# EAGLE design loki (EAGLE 6.2)
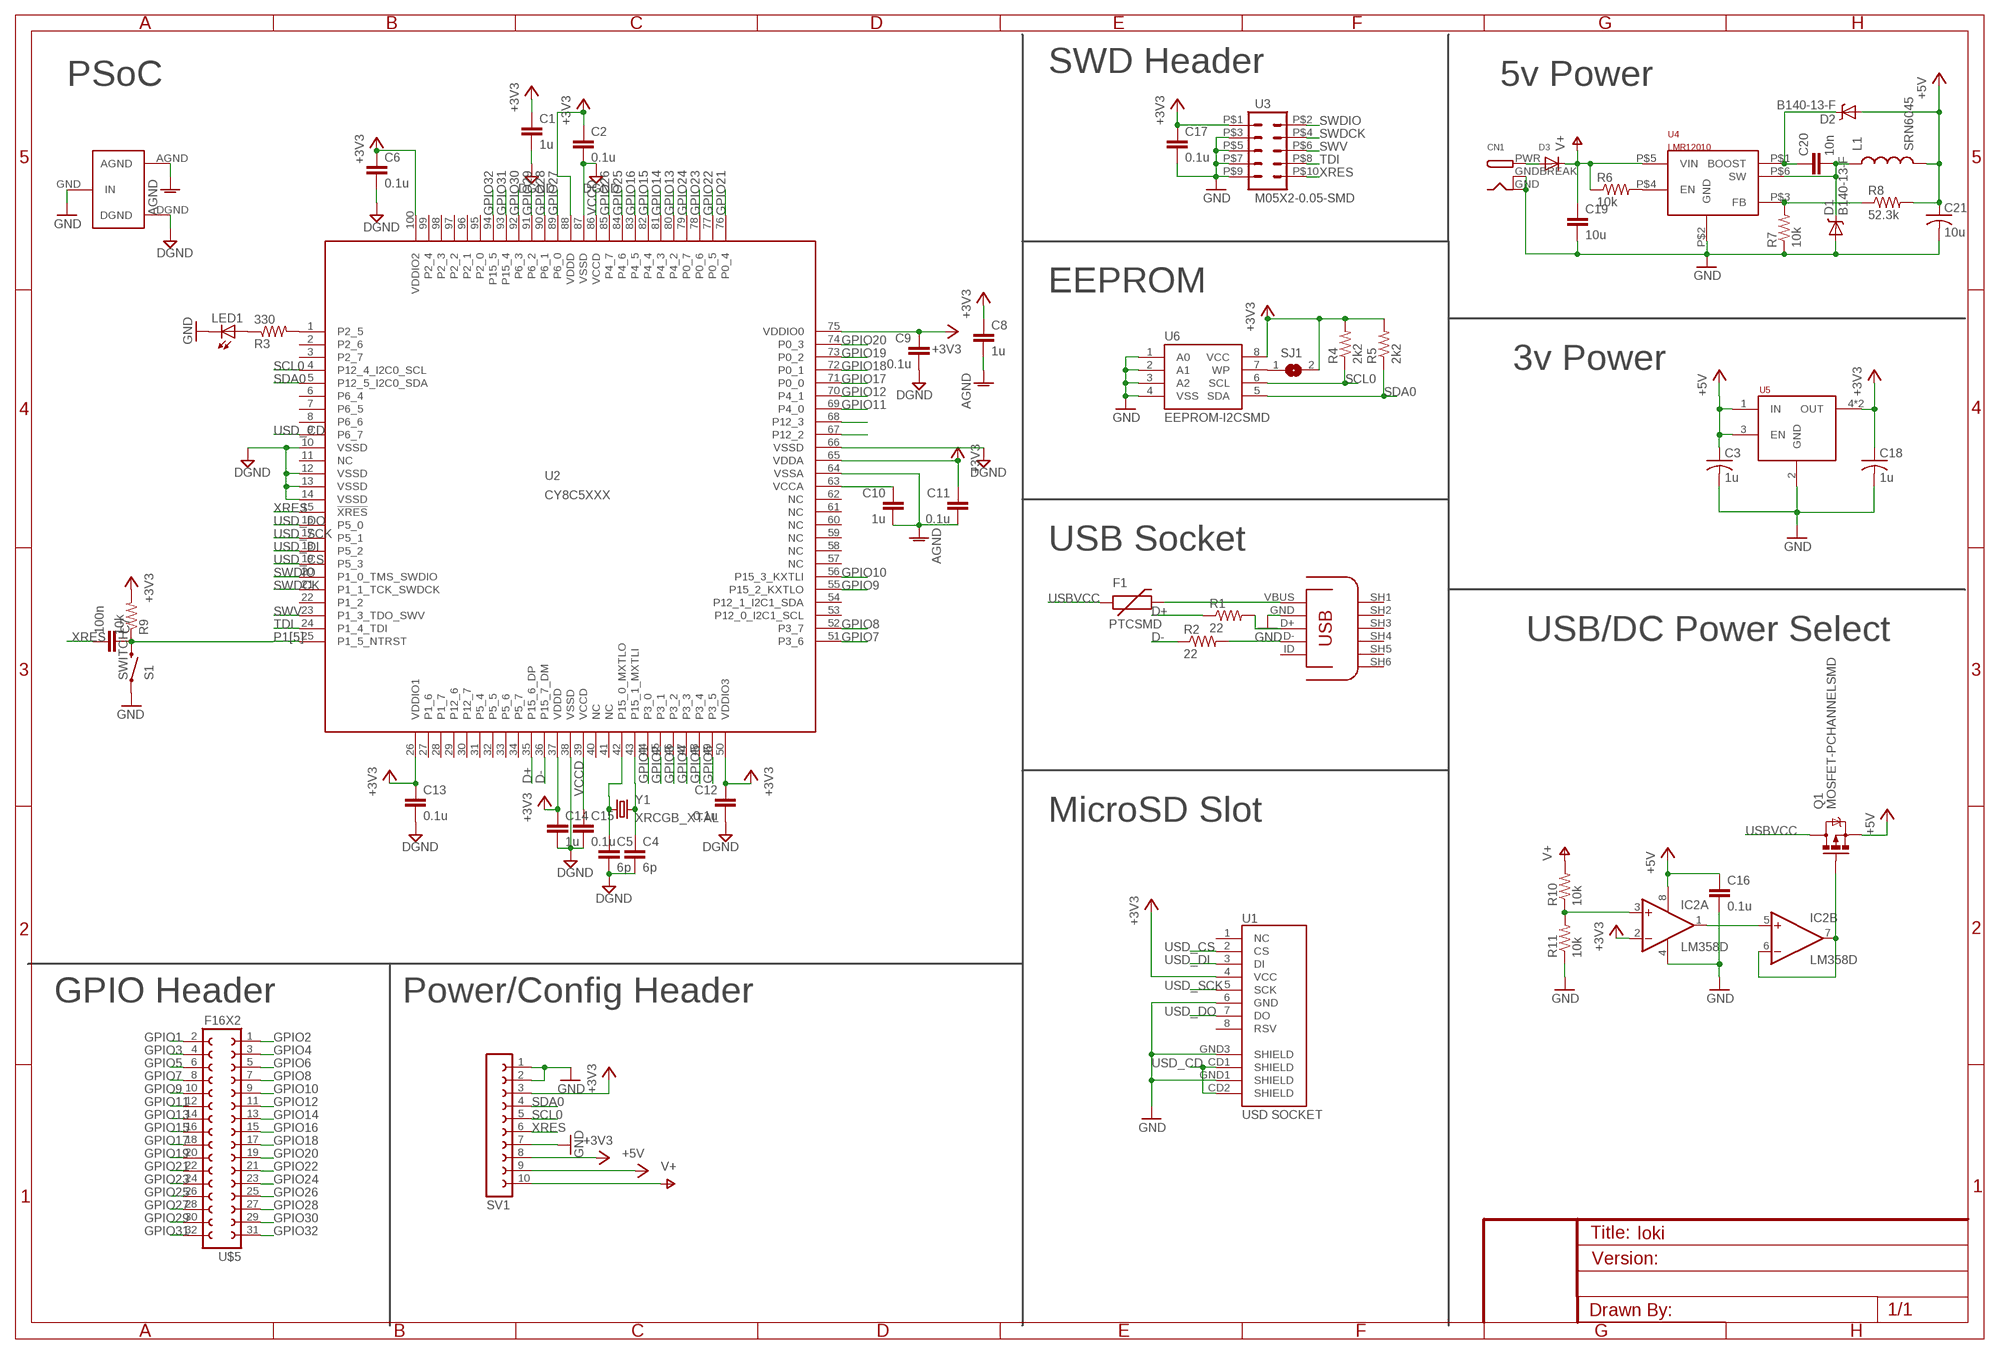
[diagram p0: schematic, sheet 1]

## Parts
C1  1u  C-EUC0603K  [C0603K]
C2  0.1u  C-EUC0603K  [C0603K]
C3  1u  C-USC0603  [C0603]
C4  6p  C-EUC0603K  [C0603K]
C5  6p  C-EUC0603K  [C0603K]
C6  0.1u  C-EUC0603K  [C0603K]
C7  100n  C-EUC0603K  [C0603K]
C8  1u  C-EUC0603K  [C0603K]
C9  0.1u  C-EUC0603K  [C0603K]
C10  1u  C-EUC0603K  [C0603K]
C11  0.1u  C-EUC0603K  [C0603K]
C12  0.1u  C-EUC0603K  [C0603K]
C13  0.1u  C-EUC0603K  [C0603K]
C14  1u  C-EUC0603K  [C0603K]
C15  0.1u  C-EUC0603K  [C0603K]
C16  0.1u  CAP0603-CAP  [0603-CAP]
C17  0.1u  C-EUC0603K  [C0603K]
C18  1u  C-USC0603  [C0603]
C19  10u  C-EUC1210  [C1210]
C20  10n  C-EUC0805  [C0805]
C21  10u  C-USC1206  [C1206]
CN1  DCBARRELPTH  [DCJACK_2MM_PTH]
D1  B140-13-F  DIODE-SCHOTTKY_  [SMA-DIODE]
D2  B140-13-F  DIODE-SCHOTTKY_  [SMA-DIODE]
D3  DIODESMA  [SMADIODE]
F1  PTCSMD  [PTC-1206]
IC2  LM358D  [SO08]
L1  SRN6045  [SRN6045]
LED1  LEDCHIP-LED0805  [CHIP-LED0805]
Q1  MOSFET-PCHANNELSMD  [SOT23-3]
R1  22  RESISTOR0603-RES  [0603-RES]
R2  22  RESISTOR0603-RES  [0603-RES]
R3  330  R-US_R0603  [R0603]
R4  2k2  R-US_R0603  [R0603]
R5  2k2  R-US_R0603  [R0603]
R6  10k  R-US_R0603  [R0603]
R7  10k  R-US_R0603  [R0603]
R8  52.3k  R-US_R0603  [R0603]
R9  10k  R-US_R0603  [R0603]
R10  10k  R-US_R0603  [R0603]
R11  10k  R-US_R0603  [R0603]
S1  SWITCH  SWITCH-MOMENTARY-2SMD  [TACTILE_SWITCH_SMD]
SJ1  SJ  [SJ]
SV1  FE10-1  [FE10]
U1  USD SOCKET  USD-SOCKETNEW  [MICRO-SD-SOCKET-PP]
U2  CY8C5XXX  CY8C5XXX-100PIN  [TQFP-14X14-100]
U3  M05X2-0.05-SMD  [PINHD-2X5-0.05-SMD]
U4  LMR12010  [TSOT-6]
U5  TLV702XX  [SOT23-5]
U6  EEPROM-I2CSMD  [SO08]
U7  MICROUSB  [USB-MICROB]
U$5  F16X2  [FE16-2]
U$9  GND_CONNECT  [GNDCONNECT]
Y1  XRCGB_XTAL  [XRCGB-XTAL]

## Nets
+3V3: C1.1 C2.1 C6.1 C8.1 C9.1 C11.1 C12.1 C13.1 C14.1 C17.1 C18.1 IC2.2(A:-IN) R4.2 R5.2 R9.2 SJ1.2 SV1.3 SV1.8 U1.4(VCC) U2.26(VDDIO1) U2.37(VDDD) U2.50(VDDIO3) U2.65(VDDA) U2.75(VDDIO0) U2.88(VDDD) U2.100(VDDIO2) U3.P$1 U5.4(OUT) U5.5(OUT) U6.8(VCC)
+5V: C3.1 C16.1 C21.1 D2.A IC2.8(P:V+) L1.P$2 Q1.2(S) R8.2 SV1.9 U5.1(IN) U5.3(EN)
AGND: C8.2 C10.2 C11.2 U2.64(VSSA) U$9.AGND
BOOST: C20.1 D2.C U4.P$1(BOOST)
CLKI: C4.1 U2.43(P15_1_MXTLI) Y1.2
CLKO: C5.1 U2.42(P15_0_MXTLO) Y1.1
D+: R1.1 U2.35(P15_6_DP)
D+IN: R1.2 U7.D+
D-: R2.1 U2.36(P15_7_DM)
D-IN: R2.2 U7.D-
DCIN: CN1.PWR D3.A
DGND: C1.2 C2.2 C4.2 C5.2 C6.2 C9.2 C12.2 C13.2 C14.2 C15.2 U2.10(VSSD) U2.12(VSSD) U2.13(VSSD) U2.14(VSSD) U2.38(VSSD) U2.66(VSSD) U2.87(VSSD) U$9.DGND
FB: R7.2 R8.1 U4.P$3(FB)
GND: C3.2 C16.2 C17.2 C18.2 C19.2 C21.2 CN1.GND CN1.GNDBREAK D1.A IC2.4(P:V-) LED1.C R7.1 R11.1 S1.1 SV1.1 SV1.2 SV1.7 U1.6(GND) U1.GND1(SHIELD) U1.GND3(SHIELD) U3.P$3 U3.P$5 U3.P$7 U3.P$9 U4.P$2(GND) U5.2(GND) U6.1(A0) U6.2(A1) U6.3(A2) U6.4(VSS) U7.GND U$9.GND(IN)
GPIO1: U2.44(P3_0) U$5.2
GPIO2: U2.45(P3_1) U$5.1
GPIO3: U2.46(P3_2) U$5.4
GPIO4: U2.47(P3_3) U$5.3
GPIO5: U2.48(P3_4) U$5.6
GPIO6: U2.49(P3_5) U$5.5
GPIO7: U2.51(P3_6) U$5.8
GPIO8: U2.52(P3_7) U$5.7
GPIO9: U2.55(P15_2_KXTLO) U$5.10
GPIO10: U2.56(P15_3_KXTLI) U$5.9
GPIO11: U2.69(P4_0) U$5.12
GPIO12: U2.70(P4_1) U$5.11
GPIO13: U2.80(P4_2) U$5.14
GPIO14: U2.81(P4_3) U$5.13
GPIO15: U2.82(P4_4) U$5.16
GPIO16: U2.83(P4_5) U$5.15
GPIO17: U2.71(P0_0) U$5.18
GPIO18: U2.72(P0_1) U$5.17
GPIO19: U2.73(P0_2) U$5.20
GPIO20: U2.74(P0_3) U$5.19
GPIO21: U2.76(P0_4) U$5.22
GPIO22: U2.77(P0_5) U$5.21
GPIO23: U2.78(P0_6) U$5.24
GPIO24: U2.79(P0_7) U$5.23
GPIO25: U2.84(P4_6) U$5.26
GPIO26: U2.85(P4_7) U$5.25
GPIO27: U2.89(P6_0) U$5.28
GPIO28: U2.90(P6_1) U$5.27
GPIO29: U2.91(P6_2) U$5.30
GPIO30: U2.92(P6_3) U$5.29
GPIO31: U2.93(P15_4) U$5.32
GPIO32: U2.94(P15_5) U$5.31
INDIN: C20.2 D1.C L1.P$1 U4.P$6(SW)
N$1: U2.67(P12_2)
N$2: R3.2 U2.1(P2_5)
N$3: C10.1 U2.63(VCCA)
N$5: R6.2 U4.P$4(EN)
N$9: SJ1.1 U6.7(WP)
N$10: U2.68(P12_3)
N$12: IC2.3(A:+IN) R10.1 R11.2
N$13: IC2.6(B:-IN) IC2.7(B:OUT) Q1.1(G)
N$14: IC2.1(A:OUT) IC2.5(B:+IN)
N$25: LED1.A R3.1
P1[5]: C7.1 R9.1 S1.3 U2.25(P1_5_NTRST)
SCL0: R4.1 SV1.5 U2.4(P12_4_I2C0_SCL) U6.6(SCL)
SDA0: R5.1 SV1.4 U2.5(P12_5_I2C0_SDA) U6.5(SDA)
SWDCK: U2.21(P1_1_TCK_SWDCK) U3.P$4
SWDIO: U2.20(P1_0_TMS_SWDIO) U3.P$2
SWV: U2.23(P1_3_TDO_SWV) U3.P$6
TDI: U2.24(P1_4_TDI) U3.P$8
USBVCC: F1.1 Q1.3(D)
USD_CD: U1.CD1(SHIELD) U1.CD2(SHIELD) U2.9(P6_7)
USD_CS: U1.2(CS) U2.19(P5_3)
USD_DI: U1.3(DI) U2.18(P5_2)
USD_DO: U1.7(DO) U2.16(P5_0)
USD_SCK: U1.5(SCK) U2.17(P5_1)
V+: C19.1 D3.C R6.1 R10.2 SV1.10 U4.P$5(VIN)
VBUS: F1.2 U7.VBUS(VCC)
VCCD: C15.1 U2.39(VCCD) U2.86(VCCD)
XRES: C7.2 SV1.6 U2.15(!XRES!) U3.P$10
Unconnected: U1.1(NC) U1.8(RSV) U2.2(P2_6) U2.3(P2_7) U2.6(P6_4) U2.7(P6_5) U2.8(P6_6) U2.11(NC) U2.22(P1_2) U2.27(P1_6) U2.28(P1_7) U2.29(P12_6) U2.30(P12_7) U2.31(P5_4) U2.32(P5_5) U2.33(P5_6) U2.34(P5_7) U2.40(NC) U2.41(NC) U2.53(P12_0_I2C1_SCL) U2.54(P12_1_I2C1_SDA) U2.57(NC) U2.58(NC) U2.59(NC) U2.60(NC) U2.61(NC) U2.62(NC) U2.95(P2_0) U2.96(P2_1) U2.97(P2_2) U2.98(P2_3) U2.99(P2_4) U7.ID U7.SH1(SH) U7.SH2(SH) U7.SH3(SH) U7.SH4(SH) U7.SH5(SH) U7.SH6(SH)

## Notes on the sheet
- SWD Header
- PSoC | 5v Power
- EEPROM
- 3v Power
- USB Socket
- USB/DC Power Select
- MicroSD Slot
- GPIO Header | Power/Config Header

## Library data of the parts
C1 C2 C4-C15 C17 C19 C20 = resistor:C-EU: CAPACITOR, European symbol
C3 C18 C21 = resistor:C-US: CAPACITOR, American symbol
C16 = SparkFun-Passives:CAP: Capacitor Standard 0603 ceramic capacitor, and 0.1" leaded capacitor.
CN1 = adafruit:DCBARREL: 2.0mm DC Barrel Jack DCJACK_2MM_PTH - Through Hole Jack (4UConnector: 05537)
D1 D2 = SparkFun-DiscreteSemi:DIODE-SCHOTTKY: Commonly MBRA140.
D3 = adafruit:DIODE: Diode SMADIODE - SMA Surface Mount Package 20V 1A Schottky Diode Digikey: 641-1014-6-ND DO-1N4148 - Through Hole Small Current Diode SOD-123 20V 1 A (.5mV Vf) Schottky Diode - Digikey: MBRX120TPMSCT-ND SOD-323 10V 570mA (.38mV Vf, 3ns) Schottky Diode - Digikey: ZLLS410CT-ND SOD-523 30V 30mA Schottky Diode (RB751S-40TE61) - Digikey: RB751S-40TE61CT-ND SOT23-R/W - SOT23 Package (R = Solder Paste/Reflow Ovens, W = Hand-Soldering) BAT54Film 40V 300mA - Digikey: 497-7162-1-ND
F1 = SparkFun-PowerIC:PTC: Resettable Fuse PTC Resettable Fuse. Spark Fun Electronics SKU : COM-08357
IC2 = linear:LM358: OP AMP also LM158; LM258; LM2904 Source: http://cache.national.com/ds/LM/LM158.pdf
L1 = nickparts:SRN6045
LED1 = led:LED: LED OSRAM: - CHIPLED LG R971, LG N971, LY N971, LG Q971, LY Q971, LO R971, LY R971 LH N974, LH R974 LS Q976, LO Q976, LY Q976 LO Q996 - Hyper CHIPLED LW Q18S LB Q993, LB Q99A, LB R99A - SideLED LS A670, LO A670, LY A670, LG A670, LP A670 LB A673, LV A673, LT A673, LW A673 LH A674 LY A675 LS A676, LA A676, LO A676, LY A676, LW A676 LS A679, LY A679, LG A679 - Hyper Micro SIDELED® LS Y876, LA Y876, LO Y876, LY Y876 LT Y87S - SmartLED LW L88C, LW L88S LB L89C, LB L89S, LG L890 LS L89K, LO L89K, LY L89K LS L896, LA L896, LO L896, LY L896 - TOPLED LS T670, LO T670, LY T670, LG T670, LP T670 LSG T670, LSP T670, LSY T670, LOP T670, LYG T670 LG T671, LOG T671, LSG T671 LB T673, LV T673, LT T673, LW T673 LH T674 LS T676, LA T676, LO T676, LY T676, LB T676, LH T676, LSB T676, LW T676 LB T67C, LV T67C, LT T67C, LS T67K, LO T67K, LY T67K, LW E67C LS E67B, LA E67B, LO E67B, LY E67B, LB E67C, LV E67C, LT E67C LW T67C LS T679, LY T679, LG T679 LS T770, LO T770, LY T770, LG T770, LP T770 LB T773, LV T773, LT T773, LW T773 LH T774 LS E675, LA E675, LY E675, LS T675 LS T776, LA T776, LO T776, LY T776, LB T776 LHGB T686 LT T68C, LB T68C - Hyper Mini TOPLED® LB M676 - Mini TOPLED Santana® LG M470 LS M47K, LO M47K, LY M47K Source: http://www.osram.convergy.de LUXEON: - LUMILED® LXK2-PW12-R00, LXK2-PW12-S00, LXK2-PW14-U00, LXK2-PW14-V00 LXK2-PM12-R00, LXK2-PM12-S00, LXK2-PM14-U00 LXK2-PE12-Q00, LXK2-PE12-R00, LXK2-PE12-S00, LXK2-PE14-T00, LXK2-PE14-U00 LXK2-PB12-K00, LXK2-PB12-L00, LXK2-PB12-M00, LXK2-PB14-N00, LXK2-PB14-P00, LXK2-PB14-Q00 LXK2-PR12-L00, LXK2-PR12-M00, LXK2-PR14-Q00, LXK2-PR14-R00 LXK2-PD12-Q00, LXK2-PD12-R00, LXK2-PD12-S00 LXK2-PH12-R00, LXK2-PH12-S00 LXK2-PL12-P00, LXK2-PL12-Q00, LXK2-PL12-R00 Source: www.luxeon.com KINGBRIGHT: KA-3528ASYC Source: www.kingbright.com
Q1 = SparkFun-DiscreteSemi:MOSFET-PCHANNEL: Generic PMOSFET
R1 R2 = SparkFun-Passives:RESISTOR: Resistor Basic schematic elements and footprints for 0603, 1206, and PTH resistors.
R3-R11 = resistor:R-US_: RESISTOR, American symbol
S1 = SparkFun-Electromechanical:SWITCH-MOMENTARY-2: Various NO switches- pushbuttons, reed, etc
SJ1 = jumper:SJ: SMD solder JUMPER
SV1 = con-lsta:FE10-1: FEMALE HEADER; OC_FARNELL: unknown; OC_NEWARK: unknown
U1 = SparkFun-Connectors:USD-SOCKET: microSD Socket Push-push type uSD socket. Schematic element and footprint production proven. Spark Fun Electronics SKU : PRT-00127. tDoc lines correctly indicate media card edge positions when inserting (unlocked, locked, depressed).
U2 = cypress_psoc_V1_0:CY8C5XXX-100PIN: Cypress PSoC® 5 - Programmable System on Chip, ARM Cortex-M3 Based Source Data: http://www.cypress.com/?mpn=CY8C5588AXI-060 LBR Source: http://www.westmarkelectronics.com Thomas W. Moxon Director of Engineering www.westmarkelectronics.com; MPN: CY8C5588AXI-060
U3 = nickparts:M05X2-0.05-SMD
U4 = nickparts:LMR12010
U5 = nickparts:TLV702XX
U6 = SparkFun-DigitalIC:EEPROM-I2C: I2C EEPROM chips, 24LC256 (and others)
U7 = ondraster:MICROUSB
U$5 = nickparts:F16X2
U$9 = nickparts:GND_CONNECT: Use to make a connection of multiple grounds in only one place.
Y1 = nickparts:XRCGB_XTAL

## Board
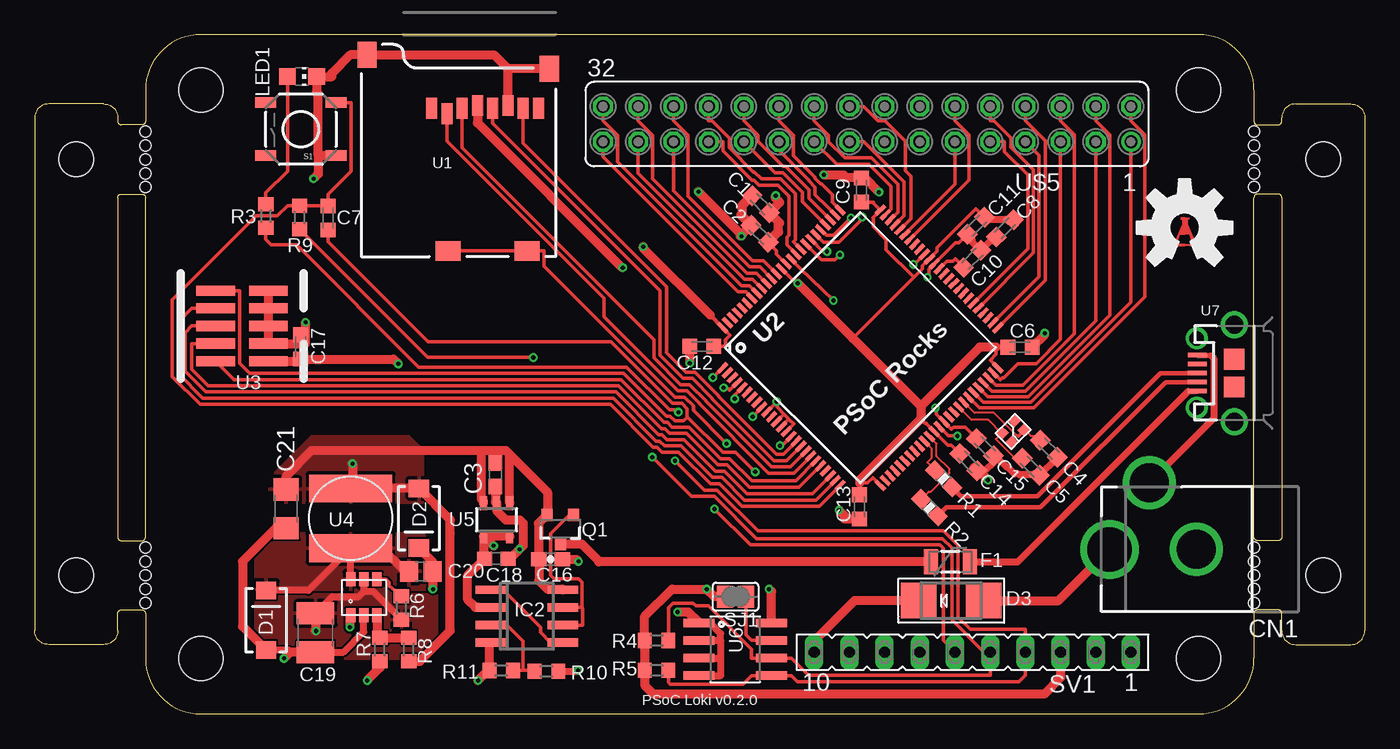
[diagram p1: board, top side]
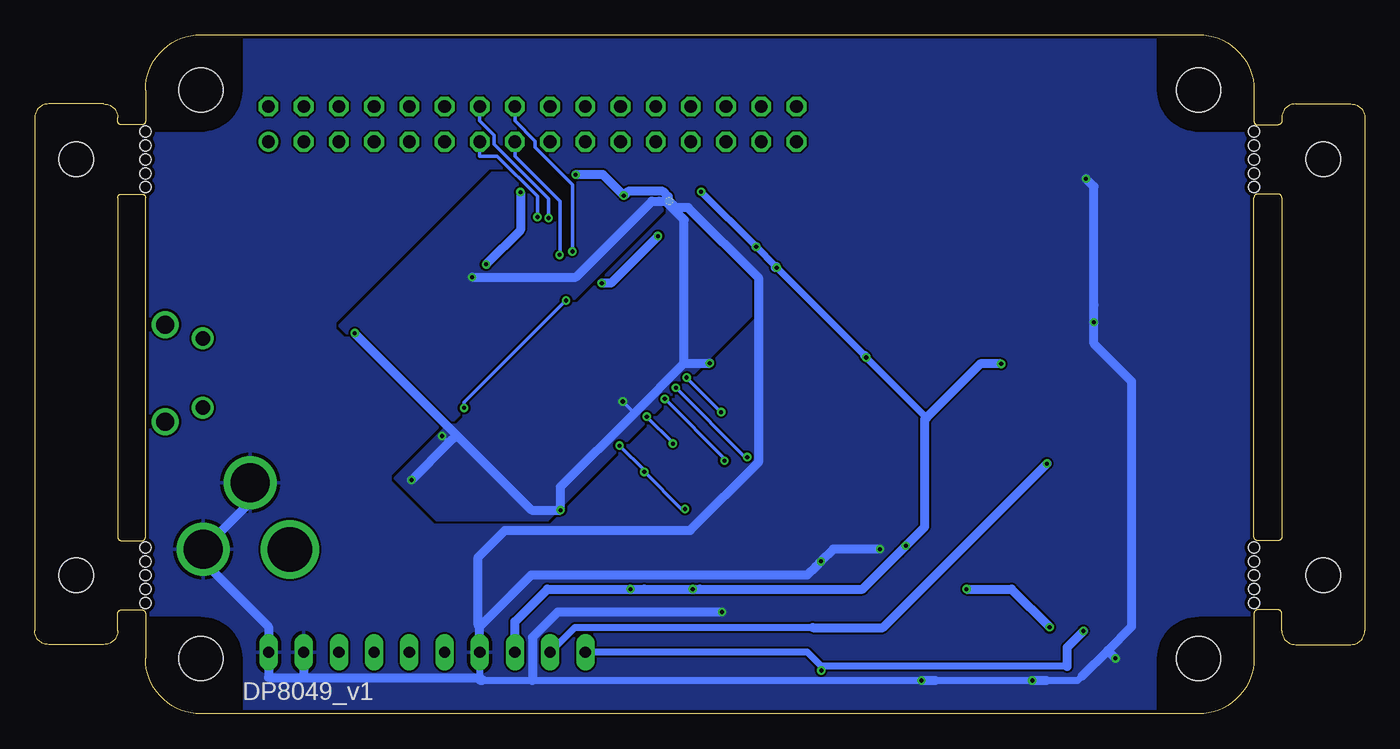
[diagram p2: board, bottom side, seen from below]

Size 96 x 49 mm. Coordinates in mm from the lower left corner, seen from the top.
Outline: 90,29 90,20
Outline: 12,0 84,0 arc90 88,4 88,7.25 arc-90 88.25,7.5 89.75,7.5 arc-90 90,7.25 90,6 arc90 91,5 95,5 arc90 96,6 96,43 arc90 95,44 91,44 arc90 90,43 90,42.75 arc-90 89.75,42.5 88.25,42.5 arc-90 88,42.75 88,45 arc90 84,49 12,49 arc90 8,45 8,42.75 arc-90 7.75,42.5 6.25,42.5 arc-90 6,42.75 6,43 arc90 5,44 1,44 arc90 0,43 0,6 arc90 1,5 5,5 arc90 6,6 6,7.25 arc-90 6.25,7.5 7.75,7.5 arc-90 8,7.25 8,4 arc90 12,0
Outline: 6,37.25 6,12.75 arc90 6.25,12.5 7.75,12.5 arc90 8,12.75 8,37.25 arc90 7.75,37.5 6.25,37.5 arc90 6,37.25
Outline: 90,37.25 90,12.75 arc-90 89.75,12.5 88.25,12.5 arc-90 88,12.75 88,37.25 arc-90 88.25,37.5 89.75,37.5 arc-90 90,37.25
Copper layers (1*16): Top 0.035mm / dielectric 1.5mm / Bottom 0.035mm
Design rules: minimum track width 6mil, minimum drill 0.3mm, track to track 6mil, track to pad 6mil, pad to pad 6mil, via to via 6mil, smd to smd 0mil, copper to edge 10mil, drill to drill 10mil, minimum pad ring 10mil, minimum via ring 6mil, stop-mask expansion 2mil, vias tented up to drill 100mil, thermal gap 10mil
Holes 3.2 mm at 12,4 84,4 84,45 12,45
Holes 2.5 mm at 3,40 3,10 93,40 93,10
Holes 0.8 mm at 8,42 8,41 8,40 8,39 8,38 8,12 8,11 8,10 8,9 8,8 88,42 88,41 88,40 88,39 88,38 88,12 88,11 88,10 88,9 88,8
tKeepout: 8 lines
bKeepout: 8 lines
tRestrict: area 8,42 to 15,49; area 81,42 to 88,49; area 8,0 to 15,7; area 81,0 to 88,7
bRestrict: area 8,42 to 15,49; area 81,42 to 88,49; area 8,0 to 15,7; area 81,0 to 88,7

### Footprints (pad centres in the part's own frame; a part is rotated, then mirrored left to right if it is on the bottom)
C0603K = smd 1.05 x 1.08: 1 -0.875,0; 2 0.875,0
C0603 = smd 1.1 x 1: 1 -0.85,0; 2 0.85,0
0603-CAP = smd 1.1 x 1: 1 -0.85,0; 2 0.85,0
C1210 = smd 1.6 x 2.7: 1 -1.4,0; 2 1.4,0
C0805 = smd 1.3 x 1.5: 1 -0.85,0; 2 0.85,0
C1206 = smd 1.6 x 1.8: 1 -1.4,0; 2 1.4,0
DCJACK_2MM_PTH = drill 2.8: GND 0,7.35; GNDBREAK 4.8,10.75 | drill 3.2: PWR 0,13.6
SMA-DIODE = smd 1.27 x 1.47: A -2.15,0; C 2.15,0
SMADIODE = smd 2.54 x 2.54: A 2.349,0; C -2.349,0
PTC-1206 = smd 1 x 1.8: 1 -1.4,0; 2 1.4,0
SO08 = smd 0.6 x 2.2: 1 -1.905,-2.6; 2 -0.635,-2.6; 3 0.635,-2.6; 4 1.905,-2.6; 5 1.905,2.6; 6 0.635,2.6; 7 -0.635,2.6; 8 -1.905,2.6
SRN6045 = smd 2 x 6: P$1 -2.15,0; P$2 2.15,0
CHIP-LED0805 = smd 1.2 x 1.2: A 0,-1.05; C 0,1.05
SOT23-3 = smd 0.8 x 0.9: 1 -0.95,-1; 2 0.95,-1; 3 0,1.1
0603-RES = smd 1.1 x 1: 1 -0.85,0; 2 0.85,0
R0603 = smd 1 x 1.1: 1 -0.85,0; 2 0.85,0
TACTILE_SWITCH_SMD = smd 1.524 x 0.762: 1 -2.54,1.905; 2 2.54,1.905; 3 -2.54,-1.905; 4 2.54,-1.905
SJ = smd 1.168 x 1.6: 1 -0.762,0; 2 0.762,0
FE10 = drill 0.813 long: 1 -11.43,0; 2 -8.89,0; 3 -6.35,0; 4 -3.81,0; 5 -1.27,0; 6 1.27,0; 7 3.81,0; 8 6.35,0; 9 8.89,0; 10 11.43,0
MICRO-SD-SOCKET-PP = smd 0.8 x 1.5: 1 -8.94,10.7; 2 -7.84,10.3; 3 -6.74,10.7; 4 -5.64,10.9; 5 -4.54,10.7; 6 -3.44,10.9; 7 -2.34,10.7; 8 -1.24,10.7 | smd 1.8 x 1.4: CD1 -2.05,0.4; CD2 -7.75,0.4 | smd 1.4 x 1.9: GND1 -13.6,14.55; GND3 -0.45,13.55
TQFP-14X14-100 = smd 0.9 x 0.3: 1 -8.05,6; 2 -8.05,5.5; 3 -8.05,5; 4 -8.05,4.5; 5 -8.05,4; 6 -8.05,3.5; 7 -8.05,3; 8 -8.05,2.5; 9 -8.05,2; 10 -8.05,1.5; 11 -8.05,1; 12 -8.05,0.5; 13 -8.05,0; 14 -8.05,-0.5; 15 -8.05,-1; 16 -8.05,-1.5; 17 -8.05,-2; 18 -8.05,-2.5; 19 -8.05,-3; 20 -8.05,-3.5; 21 -8.05,-4; 22 -8.05,-4.5; 23 -8.05,-5; 24 -8.05,-5.5; 25 -8.05,-6; 51 8.05,-6; 52 8.05,-5.5; 53 8.05,-5; 54 8.05,-4.5; 55 8.05,-4; 56 8.05,-3.5; 57 8.05,-3; 58 8.05,-2.5; 59 8.05,-2; 60 8.05,-1.5; 61 8.05,-1; 62 8.05,-0.5; 63 8.05,0; 64 8.05,0.5; 65 8.05,1; 66 8.05,1.5; 67 8.05,2; 68 8.05,2.5; 69 8.05,3; 70 8.05,3.5; 71 8.05,4; 72 8.05,4.5; 73 8.05,5; 74 8.05,5.5; 75 8.05,6 | smd 0.3 x 0.9: 26 -6,-8.05; 27 -5.5,-8.05; 28 -5,-8.05; 29 -4.5,-8.05; 30 -4,-8.05; 31 -3.5,-8.05; 32 -3,-8.05; 33 -2.5,-8.05; 34 -2,-8.05; 35 -1.5,-8.05; 36 -1,-8.05; 37 -0.5,-8.05; 38 0,-8.05; 39 0.5,-8.05; 40 1,-8.05; 41 1.5,-8.05; 42 2,-8.05; 43 2.5,-8.05; 44 3,-8.05; 45 3.5,-8.05; 46 4,-8.05; 47 4.5,-8.05; 48 5,-8.05; 49 5.5,-8.05; 50 6,-8.05; 76 6,8.05; 77 5.5,8.05; 78 5,8.05; 79 4.5,8.05; 80 4,8.05; 81 3.5,8.05; 82 3,8.05; 83 2.5,8.05; 84 2,8.05; 85 1.5,8.05; 86 1,8.05; 87 0.5,8.05; 88 0,8.05; 89 -0.5,8.05; 90 -1,8.05; 91 -1.5,8.05; 92 -2,8.05; 93 -2.5,8.05; 94 -3,8.05; 95 -3.5,8.05; 96 -4,8.05; 97 -4.5,8.05; 98 -5,8.05; 99 -5.5,8.05; 100 -6,8.05
PINHD-2X5-0.05-SMD = smd 2.794 x 0.737: P$1 1.27,5.08; P$2 5.08,5.08; P$3 1.27,3.81; P$4 5.08,3.81; P$5 1.27,2.54; P$6 5.08,2.54; P$7 1.27,1.27; P$8 5.08,1.27; P$9 1.27,0; P$10 5.08,0
TSOT-6 = smd 0.69 x 1: P$1 0,0; P$2 0.95,0; P$3 1.9,0; P$4 1.9,2.6; P$5 0.95,2.6; P$6 0,2.6
SOT23-5 = smd 0.5 x 1: 1 -0.95,-1.2; 2 0,-1.2; 3 0.95,-1.2; 4 0.95,1.2; 5 -0.95,1.2
SO08' = smd 0.61 x 2.21: 1 -1.905,-2.616; 2 -0.635,-2.616; 3 0.635,-2.616; 4 1.905,-2.616; 5 1.905,2.616; 6 0.635,2.616; 7 -0.635,2.616; 8 -1.905,2.616
USB-MICROB = smd 0.35 x 1.4: D+ 0,2.65; D- -0.65,2.65; GND 1.3,2.65; ID 0.65,2.65; VBUS -1.3,2.65 | drill 1.3 pad 1.6: SH1 -3.5,0; SH2 3.5,0 | drill 1.05 pad 1.4: SH3 2.5,2.7; SH4 -2.5,2.7 | smd 1.5 x 1.5: SH5 -1,0; SH6 1,0
FE16-2 = drill 0.914: 1 1.27,3.81 | drill 0.914 octagon: 2 1.27,1.27; 3 3.81,3.81; 4 3.81,1.27; 5 6.35,3.81; 6 6.35,1.27; 7 8.89,3.81; 8 8.89,1.27; 9 11.43,3.81; 10 11.43,1.27; 11 13.97,3.81; 12 13.97,1.27; 13 16.51,3.81; 14 16.51,1.27; 15 19.05,3.81; 16 19.05,1.27; 17 21.59,3.81; 18 21.59,1.27; 19 24.13,3.81; 20 24.13,1.27; 21 26.67,3.81; 22 26.67,1.27; 23 29.21,3.81; 24 29.21,1.27; 25 31.75,3.81; 26 31.75,1.27; 27 34.29,3.81; 28 34.29,1.27; 29 36.83,3.81; 30 36.83,1.27; 31 39.37,3.81; 32 39.37,1.27
GNDCONNECT = smd 0.635 x 0.635: AGND 0,0; DGND 0,0; GND 0,0
XRCGB-XTAL = smd 0.75 x 0.7: 1 -0.675,0.5; 2 0.675,-0.5; NC1 0.675,0.5; NC2 -0.675,-0.5

### Placement (x,y rotation side)
C1  52.41,36.77 315 top
C2  52.33,34.64 315 top
C3  33.25,17.25 270 top
C4  73.19,19.12 315 top
C5  71.9,17.83 315 top
C6  71.11,26.45 0 top
C7  21.18,35.77 270 top
C8  70.03,35.02 225 top
C9  59.66,37.79 90 top
C10  67.67,32.82 45 top
C11  67.93,35.22 225 top
C12  48.15,26.5 180 top
C13  59.53,14.93 270 top
C14  67.39,18.17 315 top
C15  68.59,19.24 315 top
C16  37.23,11.14 0 top
C17  19.2,26.48 90 top
C18  33.32,11.2 0 top
C19  20.27,5.85 270 top
C20  27.86,10.28 180 top
C21  18.16,14.79 270 top
CN1  91.19,11.87 90 top
D1  16.7,6.76 90 top
D2  27.73,14.11 270 top
D3  66.14,8.17 0 top
F1  66.09,10.97 0 top
IC2  35.52,7.04 270 top
L1  22.81,14.11 90 top
LED1  19.3,45.98 270 top
Q1  37.94,13.36 180 top
R1  65.6,16.95 315 top
R2  64.58,14.88 315 top
R3  16.69,35.91 270 top
R4  44.88,5.29 180 top
R5  44.88,3.14 180 top
R6  26.47,7.64 90 top
R7  24.91,4.64 90 top
R8  27,4.64 270 top
R9  19.12,35.81 270 top
R10  36.94,3.07 0 top
R11  33.67,3.13 0 top
S1  19.21,42.19 180 top
SJ1  50.58,8.45 180 top
SV1  67.69,4.45 180 top
U1  37.6,32.99 0 top
U2  59.59,26.41 45 top
U3  18.14,30.53 180 top
U4  22.81,7.12 0 top
U5  33.34,14 180 top
U6  EEPROM-I2CSMD  [SO08']  50.56,4.66 270 top
U7  86.56,24.59 90 top
U$1  [ARACHNID_LABS_LOGO_SM]  79,30 0 top
U$5  80.39,45.09 180 top
U$6  [LOKI_LOGO]  40.78,25.02 0 top
U$9  50.21,37 315 bottom
U$12  [OSHW-LOGO-L]  82.99,35.08 0 top
Y1  70.62,20.37 45 top

### Tracks (layer width: path | path; a pad name or v marks a point on that pad's centre or on a via)
+3V3  (via drill 0.3, 0.3 pad 0.6)
  Top 0.25: C12.1 49.88,26.5 49.88,26.99 50.2,27.32 49.76,27.76 | U2.100 49.76,27.76 | 63.45,31.49 59.05,27.09 | 63.45,31.49 64.07,32.12 64.07,32.32 U2.65 64.88,33.12 | 63.45,31.49 61.45,33.49 61.45,34.21 60.53,35.13 60.53,35.76 60.49,35.8 60.84,36.16 | U2.75 60.84,36.16 | U2.88 54.93,31.07 v55.07,31.07 | 64.88,33.12 65.12,33.36 65.12,33.63 67.94,36.45 C11.1 68.75,35.64 C8.1 | C9.1 60.53,36.91 60.53,36.85 U2.75 | U2.37 65.47,19.82 65.9,19.39 66.17,19.39 | 66.17,19.39 | 66.17,19.39 C14.1 | U2.37 64.38,20.92 64.34,20.95 64.24,20.95 63.93,21.25 63.91,21.28 | U2.50 69.24,25.24 | 69.24,25.24 68.97,25.51 69.39,25.93 69.39,26.45 C6.1 | C13.1 59.53,16.66 60.12,16.66 60.49,17.03 U2.26 | U2.75 | U2.75 60.84,36.16 | U2.65 | U2.65 64.88,33.12 | U2.50 | U2.50 69.24,25.24 | U2.37 | U2.37 | U2.88 | U2.88 | C2.1 | C2.1 | C1.1 | C1.1 | C14.1 | C14.1 | U2.26 | U2.26 | U2.100 | U2.100 49.76,27.76 | v35.99,25.71 28.36,25.71 R9.2
  Top 0.3: U2.100 48.77,28.75 48.77,28.76
  Top 0.5: C8.1 68.75,35.64 C11.1 | IC2.2 32.07,7.68
  Top 0.635: SV1.3 74.04,2.61 72.86,1.43 44.67,1.43 44.03,2.07 R5.2 R4.2 44.03,7.03 46,9 v48.5,9 49.05,8.45 SJ1.2 | v42.44,32.19 42.39,32.19 31.96,42.63 U1.4 | 48.77,28.76 43.92,33.61 v43.92,33.7 | v55.07,31.07 59.05,27.09 63.95,22.19 | C1.1 51.04,36.64 | 50.97,34.51 50.93,34.47 | 50.97,34.51 C2.1 50.97,35.99 51.04,36.06 51.04,36.64 | 50.97,34.51 v51.02,34.47 51.02,34.56 v47.91,37.67 | 51.04,36.64 | 63.93,21.25 59.53,16.85 59.53,16.66 | 63.95,22.19 63.95,21.32 63.91,21.28 | 69.39,26.45 68.21,26.45 63.95,22.19 | U6.8 53.18,8.82 v53,9 | U5.4 32.39,11.28 C18.1 31.25,9.99 31.25,8.25 31.82,7.68 32.07,7.68 | U5.5 U5.4 | U5.4 32.45,12.8 v33.12,12.12 | U3.P$1 19.2,25.45 C17.1 25.9,25.6 v26.25,25.25
  Bottom 0.5: 31.61,21.34 31.64,21.36 v35.99,25.71 | 36.09,25.84 v42.44,32.19 | v47.91,37.67 43.95,33.72 | 42.49,32.27 v43.92,33.7
  Bottom 0.635: v35.99,25.71 35.99,25.74 36.09,25.84 | v42.44,32.19 42.49,32.19 | 42.49,32.19 42.56,32.19 | 42.49,32.19 42.49,32.27 | v43.92,33.7 43.94,33.7 43.95,33.72 | v51.02,34.47 54.41,31.07 v55.07,31.07 | 31.75,13.5 31.75,15 | 31.75,15 31.75,21.25 31.64,21.36 27.75,25.25 v26.25,25.25 | 31.75,13.5 31.75,15 | SV1.8 61.34,6.66 59,9 v53,9 | v53,9 52,9 | 52,9 v48.5,9 | v48.5,9 48,9 | 48,9 36.25,9 33.62,11.62 | 33.62,11.62 v33.12,12.12 | v33.12,12.12 31.75,13.5 | v48.5,9 48,9 | v53,9 52,9 | v33.12,12.12 33.62,11.62
+5V  (via drill 0.3)
  Top 0.5: 24.32,16.25 25.34,16.25
  Top 0.635: L1.P$2 21,16.25 | 24.32,16.25 L1.P$2 | R8.2 27.79,3.79 30,6 30,13 30,13.99 D2.A 24.31,16.27 24,15.96 | 25,16 24.96,15.96 24,15.96 | 24,15.96 23.11,15.96 L1.P$2 | C21.1 18.16,17.16 20,19 22,19 32.25,19 | v22.95,18.05 22.95,16.39 L1.P$2 | IC2.8 38.06,9 37,9 36.39,9.62 C16.1 36.39,13.71 36.36,13.73 Q1.2 37,16 34.12,18.88 | 32.25,19 33,19 | 33,19 34,19 34.12,18.88 | C3.1 33.25,18.75 33,19 | U5.3 32.39,15.36 32.25,15.5 32.25,19 | U5.1 34.29,18.71 34.12,18.88
  Bottom 0.5: SV1.9 57.03,6.22 39.83,6.22
  Bottom 0.635: 39.83,6.22 34.78,6.22 v22.95,18.05
  pour Top: 27,20 20,20 17,17 17,15.25 28,15.25 28,19
AGND  (via drill 0.3 pad 0.6)
  Top 0.25: 64.73,32.27 U2.64 66.46,34 66.71,34 | 64.73,32.27 64.53,32.06 64.53,31.6 v64.43,31.5 | C11.2 | C11.2 66.71,34 | 66.71,34 | U2.64 | U2.64 64.73,32.27 | C11.2 | C10.2 | C8.2
  Top 0.5: C10.2 67.59,34.14 67.68,34.23 C11.2 | C10.2 | C10.2 68.97,34.13 69.14,34.13 C8.2 | C8.2
  Bottom 0.635: v64.43,31.5 56.94,31.5 51.45,36.99 50.92,36.99 50.23,36.99 U$9.AGND
  pour Bottom (rank 4): 66.5,20.5 74,28 63,39 55,39 55,38.75 53.5,37.25 50.5,37.25 50,37
BOOST  (via drill 0.3)
  Top 0.635: D2.C 28.71,10.98 C20.1 28.71,9.04 v28.75,9 | v22.75,6.25 22.75,7.06 U4.P$1
  Bottom 0.635: v28.75,9 25.5,9 v22.75,6.25
CLKI
  Top 0.152: U2.43 67.83,21.71 69.23,21.71 70.84,20.09 70.92,20.09 70.99,20.03 Y1.2 71.89,20.05 72.26,20.05 C4.1
  Top 0.25: U2.43 | U2.43 | C4.1 | C4.1 | Y1.2 70.99,20.03
CLKO
  Top 0.152: U2.42 66.91,21.91 67.61,21.22 68.82,21.22 Y1.1 69.36,19.82 69.75,19.43 | 69.75,19.43 | 69.75,19.43 70.73,18.45 C5.1
  Top 0.25: U2.42 | U2.42 66.91,21.91 | Y1.1 | Y1.1 | C5.1 | C5.1
D+
  Top 0.152: U2.35 64.73,19.15 | 64.73,19.15 | 64.73,19.15 64.73,18.45 64.42,18.14 64.78,17.78 R1.1
  Top 0.25: U2.35 | U2.35 | R1.1 | R1.1 64.78,17.78
D+IN
  Top 0.25: R1.2 | R1.2
  Top 0.32: R1.2 66.85,15.71 72.35,15.71 81.23,24.59 U7.D+
D-
  Top 0.152: R2.1 64.25,15.75 64.53,16.03 64.68,16.03 66.02,17.38 66.02,17.67 65.08,18.6 65.08,19.5 U2.36
  Top 0.25: U2.36 | U2.36 64.79,19.79 | U2.36 | R2.1 64.25,15.75
D-IN
  Top 0.25: R2.2 | R2.2
  Top 0.32: U7.D- 81.63,23.94 72.58,14.89 65.79,14.89 R2.2
DCIN
  Top 0.635: D3.A 73.89,8.17 CN1.PWR
DGND  (via drill 0.3 pad 0.6)
  Top 0.25: U2.14 54.8,20.92 54.59,21.12 54.55,21.12 54.42,21.25 | 53.56,22.33 v53.56,22.54 | 54.09,21.62 53.56,22.15 53.56,22.33 | 53.56,22.33 53.38,22.33 U2.10 | U2.66 63.48,32.42 v63.42,32.42 | U2.87 53.7,33.01 53.55,33.16 53.55,33.42 C2.2 | U2.38 65.95,20.05 v66.59,20.05 | 54.09,21.62 54.44,21.27 54.42,21.25 | U2.12 54.09,21.62 | 54.09,20.91 U2.13 54.09,20.91 | 54.09,20.91 54.42,21.25 | U2.66 | U2.66 | U2.38 | U2.38 | U2.14 | U2.14 | U2.12 | U2.12 | U2.10 | U2.10 | U2.87 | U2.87 | C1.2 | C1.2 53.09,36.09 | C2.2 | C2.2 52.98,33.98 C2.2 | C2.2 | C2.2 | C2.2 | C15.2 | C15.2 | C14.2 68.12,17.55 68.34,17.34 | C5.2 | C5.2 | C4.2 | C4.2 73.65,18.35
  Top 0.5: 67.85,17.72 67.9,17.77 | 67.8,17.78 67.8,17.77 | 69.44,18.38 68.36,17.31 | 69.44,18.38 C15.2 | 72.52,17.24 C5.2 | C4.2 73.65,18.35 72.54,17.24 72.52,17.24 | 72.52,17.24 71.07,17.24 71.01,17.31 70.72,17.31 70.23,17.8 70.15,17.8 69.57,18.38 69.44,18.38
  Top 0.635: v53.48,37.38 53.48,37.2 53.78,36.9 C1.2 53.09,36.09 53.77,35.42 53.7,35.34 53.7,34.77 | v60.94,37.64 59.91,38.66 C9.2 58.61,38.66 58.4,38.87 56.98,38.87 v56.95,38.9 | C2.2 53.7,34.77 | 53.7,34.77 | C6.2 72.9,27.36 v72.9,27.46 | C12.2 v47.27,25.3 v47.28,25.3 | C13.2 58.47,14.06 58.47,14.27 v58.05,14.7 | 67.8,17.77 67.81,17.77 67.85,17.72 67.85,17.71 C14.2 | 67.9,17.77 68.34,17.34 68.36,17.31 v68.8,16.87
  Bottom 0.25: 66.11,19.56 v66.59,20.05 | v53.56,22.54 52.72,21.7 | U$9.DGND 50.21,36.86 50.28,36.79
  Bottom 0.635: 49.13,25.3 49.13,35.64 50.28,36.79 50.28,37.32 50.66,37.7 53.17,37.7 v53.48,37.38 54.99,38.9 v56.95,38.9 | 49.13,25.3 v47.28,25.3 | 49.13,25.3 52.72,21.7 58.05,16.38 v58.05,14.7 60.13,14.7 65.55,20.12 | v60.94,37.64 60.94,34.9 v63.42,32.42 | v56.95,38.9 | v72.9,27.46 65.55,20.12 | v68.8,16.87 66.11,19.56 65.55,20.12
  pour Bottom (rank 5): 50,37 70,17 67,14 59,14 44,29 44,31
FB
  Top 0.635: U4.P$3 24.71,5.69 R7.2 R8.1
GND  (via drill 0.3, 0.3 pad 0.6)
  Top 0.35: U7.GND 84.86,25.89 84.94,25.81
  Top 0.5: 49.5,5.29 U6.2 49.5,5.29 | 49.5,5.29 49.5,5.79 48.73,6.57 U6.1 | U6.1 | 49.5,5.29 49.5,4.07 49.45,4.03 | U6.4 49.5,2.75 49.5,3.98 49.45,4.03 | U4.P$2 23.76,5.92 22.29,4.45 C19.2 18.47,4.45 18.31,4.61 D1.A | 84.94,25.81 85.1,25.65 85.1,21.33 CN1.GNDBREAK | U6.3 49.45,4.03
  Top 0.635: U6.1 47.16,7.35 v46.4,7.35 | 34.16,46.55 33.16,47.55 U1.GND1 22.78,47.55 21.47,46.23 21.47,45.98 LED1.C 20.35,44.86 20.48,44.73 20.48,40.28 | U1.6 34.16,46.55 | U1.GND3 34.16,46.55 | U3.P$9 U3.P$7 U3.P$5 U3.P$3 19.2,26.71 | 20.48,40.28 20.48,38.95 v20.13,38.61 | S1.1 20.48,40.28 | 33.34,16.54 33.25,16.45 C3.2 33.25,15.29 U5.2 33.34,14.66 34,14 35,14 35.25,13.75 35.25,12.14 v35,11.89 34.32,11.2 C18.2 | C19.2 18.45,4.45 v18,4 | R7.1 24.91,3.31 v24,2.41 | C21.2 17.39,13.39 15,11 15,6.31 D1.A | v32,2.41 32.72,3.13 R11.1 32.82,5.04 IC2.4 | C16.2 39.11,11.14 v39.25,11 | 19.2,26.71 C17.2 | 19.2,26.71 19.55,26.71 v19.55,28.25
  Bottom 0.5: 63.88,6.22 SV1.7 63.88,2.61 63.88,2.44 | 63.65,2.44 60.08,2.44 | 60.08,2.41 v32,2.41 31,2.41 v24,2.41 23,2.41 20.72,2.41 20.39,2.74 | 38.14,11.89 38,11.89 v35,11.89
  Bottom 0.635: 63.88,6.28 63.99,6.39 63.99,11.31 62.05,13.24 48.7,13.24 43.74,18.2 43.74,31.42 48.83,36.52 49.73,36.52 U$9.GND | SV1.7 63.88,6.28 | v19.55,28.25 19.55,29.5 | 19.55,29.5 19.55,38.03 v20.13,38.61 | 16.84,21 16.84,23.99 19.55,26.71 v19.55,28.25 | 16.84,21 16.84,20 | 16.84,20 16.84,6.29 18.56,4.56 | 18.56,4.56 20.39,2.74 | v46.4,7.35 58.26,7.35 60.08,5.53 60.08,2.44 60.08,2.41 | CN1.GNDBREAK 80.44,15.27 CN1.GND 83.83,11 79.12,6.28 SV1.1 79.12,2.61 76.58,2.61 | 63.88,2.44 63.65,2.44 | SV1.2 76.58,2.61 | 76.58,2.61 63.88,2.61 | 16.84,21 16.84,20 | v18,4 18.56,4.56 | v24,2.41 23,2.41 | v32,2.41 31,2.41 | 38.14,11.89 38.36,11.89 v39.25,11 | v39.25,11 39.62,10.62 | 39.62,10.62 40.25,10 60.16,10 63.88,6.28 | v39.25,11 39.62,10.62 | v35,11.89 38,11.89 | v19.55,28.25 19.55,29.5
  pour Bottom (rank 6): 8,0 88,0 88,49 8,49
GPIO1
  Top 0.25: U$5.2 79.12,42.78 80.12,41.78 80.12,30.1 72.1,22.07 68.17,22.07 U2.44 | U2.44 | U2.44
GPIO2
  Top 0.25: U$5.1 79.12,29.69 71.9,22.47 68.48,22.47 U2.45 | U2.45 | U2.45
GPIO3
  Top 0.25: U$5.4 76.58,42.78 77.59,41.77 77.59,28.75 71.72,22.88 68.78,22.88 U2.46 | U2.46 | U2.46
GPIO4
  Top 0.25: U$5.3 76.58,28.35 71.52,23.28 69.08,23.28 U2.47 | U2.47 | U2.47
GPIO5
  Top 0.25: U$5.6 74.04,42.78 75.03,41.79 75.03,27.41 71.31,23.69 69.38,23.69 U2.48 | U2.48
GPIO6
  Top 0.25: U$5.5 74.04,27.02 72.29,25.27 70.95,25.27 69.94,24.25 69.84,24.25 69.68,24.1 U2.49 | U2.49 | U2.49
GPIO7
  Top 0.25: U$5.8 71.5,42.78 72.94,41.34 72.94,31.29 U2.51 | U2.51 | U2.51
GPIO8
  Top 0.25: U$5.7 72.49,40.29 72.49,31.54 U2.52 | U2.52 | U2.52
GPIO9
  Top 0.25: U$5.10 68.96,42.78 69.22,42.78 70.45,41.55 70.45,40.87 72.09,39.24 72.09,33.26 U2.55 | U2.55 | U2.55
GPIO10
  Top 0.25: U$5.9 70,41.27 70,40.56 71.68,38.88 71.68,33.56 68.06,29.94 | 68.06,29.94 U2.56 | U2.56 | U2.56 68.06,29.94
GPIO11
  Top 0.25: U$5.12 66.42,42.78 67.41,41.79 67.41,38.48 U2.69 | U2.69 | U2.69
GPIO12
  Top 0.25: U$5.11 66.42,38.2 63.11,34.89 | 63.11,34.89 U2.70 | U2.70 | U2.70 63.11,34.89
GPIO13  (via drill 0.3 pad 0.6)
  Top 0.25: U2.80 56.83,34.83 | 56.83,34.83 57.13,34.52 57.66,34.52 v58.91,35.77 | U2.80 | U2.80 56.83,34.83
  Bottom 0.25: v58.91,35.77 58.91,37.16 62.84,41.09 62.84,41.74 63.88,42.78 U$5.14
GPIO14  (via drill 0.3 pad 0.6)
  Top 0.25: U2.81 56.93,34.02 58.05,34.02 59.72,35.69 v59.72,35.85 | U2.81 | U2.81
  Bottom 0.25: v59.72,35.85 59.72,37.32 62.63,40.24 63.88,40.24 U$5.13
GPIO15  (via drill 0.3 pad 0.6)
  Top 0.25: U2.82 56.89,33.36 v57.19,33.36 | U2.82 | U2.82
  Bottom 0.25: v57.19,33.36 57.19,38.18 59.89,40.88 59.89,41.33 61.34,42.78 U$5.16
GPIO16  (via drill 0.3 pad 0.6)
  Top 0.25: U2.83 56.77,32.77 57.77,32.77 v58.12,33.12
  Bottom 0.25: U$5.15 61.34,40.24 58.06,36.96 58.06,33.34 v58.12,33.12
GPIO17
  Top 0.25: U$5.18 59.84,43.81 60.87,42.78 61.35,42.78 62.83,41.3 62.83,39.19 63.23,38.79 63.23,35.72 U2.71 | U2.71 | U2.71
GPIO18
  Top 0.25: U2.72 62.74,35.93 62.74,38.4 59.86,41.27 U$5.17 | U2.72 | U2.72
GPIO19
  Top 0.25: U$5.20 56.26,42.78 57.3,41.74 57.3,41.28 58.47,40.11 60.39,40.11 62.29,38.21 62.29,36.19 62.05,35.95 | 62.05,35.95 U2.73 62.05,35.95
GPIO20
  Top 0.25: U$5.19 57.89,39.64 60.22,39.64 61.81,38.06 61.81,36.41 U2.74 | U2.74 | U2.74
GPIO21
  Top 0.25: U2.76 57.59,36.9 57.59,37.43 56.78,38.24 56.72,38.24 56.33,38.63 56.33,38.7 54.76,40.27 54.76,41.74 53.72,42.78 U$5.22 | U2.76 | U2.76
GPIO22
  Top 0.25: U$5.21 53.72,40.67 55.88,38.51 55.88,38.45 56.31,38.01 56.31,37.46 57.23,36.54 U2.77 | U2.77 | U2.77
GPIO23
  Top 0.25: U2.78 55.87,37.21 55.87,37.82 54.19,39.49 54.02,39.49 52.22,41.3 52.22,41.74 51.18,42.78 U$5.24 | U2.78 | U2.78
GPIO24
  Top 0.25: U$5.23 53.41,39.04 54.01,39.04 55.41,37.63 55.41,36.95 U2.79 | U2.79 | U2.79
GPIO25
  Top 0.25: U2.84 54.76,34.07 54.89,34.2 54.89,37.52 53.82,38.59 52.46,38.59 51.97,39.08 51.88,39.08 50.14,40.83 50.14,41.54 48.9,42.78 48.64,42.78 U$5.26 | U2.84 | U2.84
GPIO26
  Top 0.25: U2.85 54.29,33.83 54.29,34.39 54.44,34.55 54.44,37.34 53.63,38.14 52.27,38.14 51.91,38.51 51.78,38.51 49.68,40.61 49.68,41.27 U$5.25 | U2.85 | U2.85
GPIO27
  Top 0.25: U$5.28 46.1,42.78 47.14,41.74 47.14,37.35 51.79,32.7 52.59,32.7 U2.89 | U2.89 | U2.89
GPIO28
  Top 0.25: U$5.27 46.1,37.75 51.6,32.25 52.33,32.25 U2.90
GPIO29
  Top 0.25: U$5.30 43.56,42.78 44.6,41.74 44.6,38.62 51.41,31.8 52.08,31.8 U2.91 | U2.91 | U2.91
GPIO30
  Top 0.25: U$5.29 43.56,39.01 51.21,31.35 51.82,31.35 U2.92 | U2.92 | U2.92
GPIO31
  Top 0.25: U$5.32 41.02,42.78 42.06,41.74 42.06,39.84 51.01,30.89 51.58,30.89 U2.93 | U2.93 | U2.93
GPIO32
  Top 0.25: U$5.31 41.02,40.19 50.77,30.44 51.32,30.44 U2.94 | U2.94 | U2.94
INDIN
  Top 0.5: U4.P$6 L1.P$1 19.76,8.91 D1.C
  Top 0.635: C20.2 26.73,10.28 25,12 22.86,12 L1.P$1
  pour Top: 16,9 16,12 17,13 28,13 29,12 29,9
N$2  (via drill 0.3 pad 0.6)
  Top 0.25: v46.46,21.77 46.29,21.93 45.8,21.93 42.72,25.02 27.72,25.02 18.9,33.85 17.07,33.85 16.69,34.23 R3.2 | U2.1 49.1,24.42 | v48.95,24.27 49.09,24.42 49.1,24.42 | 49.1,24.42 | U2.1 | U2.1
  Bottom 0.25: v48.95,24.27 48.95,24.25 v46.46,21.77
N$3
  Top 0.25: U2.63 | U2.63 65.83,32.65 66.28,32.65 66.44,32.82 C10.1 | U2.63 | C10.1
N$5
  Top 0.25: R6.2 25.59,9.24 25.59,9.51 25.38,9.72 U4.P$4
N$9
  Top 0.25: U6.7 51.75,5.29 51.35,5.7 SJ1.1
N$12
  Top 0.25: R11.2 35.25,3.13 | 35.25,3.13 36.02,3.13 R10.1 | IC2.3 34.09,6.41 35.25,5.25 35.25,3.13
N$13
  Top 0.25: IC2.6 39.54,6.41 39.54,7.63 39.49,7.68 | IC2.7 39.49,7.68 | 39.5,7.69 39.49,7.68 | Q1.1 38.61,14.36 37.25,13 37.25,10 37.5,9.75 39.25,9.75 39.5,9.5 39.5,7.69 | 39.5,7.69 39.49,7.68
N$14
  Top 0.25: IC2.5 37.25,5.14 36.5,5.89 36.5,6.25 33.8,8.95 IC2.1
N$25
  Top 0.25: R3.1 16.69,37.58 18.25,39.14 LED1.A
P1[5]
  Top 0.25: U2.25 56.63,14.97 51.06,14.97 49.44,16.59 48.78,16.59 46.48,18.89 45.27,18.89 44.92,19.23 44.63,19.23 41.54,22.32 11.94,22.32 9.93,24.33 9.93,29.87 15.98,35.92 17.51,35.92 18.24,36.66 R9.1 19.99,36.66 20,36.65 C7.1 21.18,37.5 22.84,39.16 22.84,44.09 S1.3 | U2.25 | U2.25
SCL0  (via drill 0.3 pad 0.6)
  Top 0.25: v44.58,18.52 47.41,15.68 49.07,15.68 52.11,12.65 65.51,12.65 66.19,11.97 66.19,6.78 68.52,4.45 SV1.5 68.96,2.8 55.83,2.8 54.61,4.03 U6.6 51.75,4.03 51.75,4.66 48.61,7.79 47.71,7.79 47.51,8 46.06,8 45.73,7.66 R4.1 | U2.4 50.16,23.36 50.08,23.44 49.81,23.44 v49.72,23.52 | U2.4 | U2.4
  Bottom 0.25: v49.72,23.52 44.72,18.52 v44.58,18.52
SDA0  (via drill 0.3 pad 0.6)
  Top 0.25: R5.1 45.73,2.26 45.87,2.13 51.12,2.13 51.75,2.75 U6.5 54.61,2.75 55.05,2.32 71.02,2.32 71.5,2.8 SV1.4 71.5,6.09 67.53,6.09 66.63,6.98 66.63,12.16 65.59,13.21 52.19,13.21 49.26,16.13 48.34,16.13 v46.22,18.26 | U2.5 50.52,23 v50.52,22.72 | U2.5 | U2.5
  Bottom 0.25: v50.52,22.72 46.22,18.41 v46.22,18.26
SWDCK
  Top 0.25: U2.21 55.17,16.34 51.6,16.34 49.97,17.97 49.31,17.97 47.04,20.24 45.82,20.24 45.48,20.58 45.23,20.58 42.14,23.67 12.54,23.67 11.34,24.87 11.34,26.71 U3.P$4 | U2.21 | U2.21
SWDIO
  Top 0.25: U3.P$2 14.39,24.12 42.33,24.12 45.41,21.03 45.67,21.03 46.01,20.69 47.22,20.69 49.49,18.42 50.16,18.42 51.75,16.82 54.94,16.82 U2.20 | U2.20 | U2.20
SWV
  Top 0.25: U2.23 56.13,15.89 51.41,15.89 49.78,17.52 49.12,17.52 46.85,19.79 45.64,19.79 45.29,20.13 45.04,20.13 41.95,23.22 12.35,23.22 10.85,24.72 10.85,27.5 11.34,27.98 U3.P$6 | U2.23 | U2.23
TDI
  Top 0.25: U2.24 56.37,15.42 51.24,15.42 49.59,17.07 48.93,17.07 46.66,19.34 45.45,19.34 45.11,19.68 44.85,19.68 41.77,22.77 12.14,22.77 10.38,24.53 10.38,28.3 11.34,29.25 U3.P$8 | U2.24
USBVCC
  Top 0.635: F1.1 40.73,10.97 40.73,11.02 39.5,12.25 37.95,12.25 Q1.3
USD_CD  (via drill 0.3 pad 0.6)
  Top 0.25: U1.CD2 U1.CD1 36.77,33.4 36.77,32.3 46.23,22.84 46.9,22.84 47.53,22.21 47.53,21.9 v49.94,19.5 | U2.9 51.82,21.48 v51.82,21.44 | U2.9 | U2.9
  Bottom 0.25: v51.82,21.44 49.94,19.56 v49.94,19.5
USD_CS
  Top 0.25: U1.2 29.76,41.31 41.08,29.99 41.08,28.65 46.44,23.29 47.09,23.29 47.98,22.4 47.98,22.36 52.97,17.38 54.79,17.38 U2.19 | U2.19 | U2.19
USD_DI
  Top 0.25: U1.3 30.86,40.84 44.69,27.01 44.69,25.67 46.62,23.74 47.28,23.74 48.44,22.59 48.44,22.55 53.16,17.83 54.53,17.83 U2.18 | U2.18 | U2.18
USD_DO
  Top 0.25: U2.16 54.95,19.63 54.05,18.73 53.53,18.73 49.34,22.92 49.34,22.96 47.65,24.64 47,24.64 45.59,26.05 45.59,30.83 35.26,41.17 35.26,42.62 U1.7 | U2.16 | U2.16
USD_SCK
  Top 0.25: U2.17 54.28,18.28 53.35,18.28 48.88,22.74 48.88,22.77 47.46,24.19 46.81,24.19 45.14,25.86 45.14,30.53 33.06,42.62 U1.5 | U2.17 | U2.17
V+  (via drill 0.3 pad 0.6)
  Top 0.5: C19.1 21.47,8.45 23.39,8.45 23.76,8.82 | U4.P$5 23.76,8.82 | R6.1 25.73,7.54 24.45,8.82 23.76,8.82 | R10.2 39.17,3.07 v39.23,3.12
  Top 0.635: C19.1 20.27,6.02 v20.31,5.97 | D3.C 59.17,8.17 56,5 56,4.71 SV1.10
  Bottom 0.5: 39.23,3.43 40.24,4.45 SV1.10 | v39.23,3.12 39.23,3.43 | 21.48,3.43 39.23,3.43
  Bottom 0.635: 21.48,3.43 21.48,4.8 v20.31,5.97
  pour Top (rank 2): 29,4 16,4 16,9 22,9 23,10 29,10
VBUS
  Top 0.35: 83.24,23.27 83.89,23.27 U7.VBUS
  Top 0.5: F1.2 70.95,10.97 83.24,23.27
VCCD  (via drill 0.3 pad 0.6)
  Top 0.25: U2.39 66.18,20.53 66.28,20.62 66.33,20.68 66.9,20.68 66.91,20.67 67.16,20.67 C15.1 | U2.39 65.08,21.62 65.08,21.99 v65,22.07 | v57.65,29.82 55.29,32.13 U2.86 | U2.39 | U2.39 | U2.86 | C15.1 | C15.1
  Bottom 0.25: v65,22.07 65,22.47 v57.65,29.82
XRES  (via drill 0.3 pad 0.6)
  Top 0.25: 47.09,21.38 46.84,21.14 46.2,21.14 45.85,21.48 45.6,21.48 42.51,24.57 15.52,24.57 14.78,25.3 14.78,30.52 U3.P$10 | 47.09,21.38 47.09,22.03 46.72,22.39 46.04,22.39 41.59,26.84 28.39,26.84 21.18,34.05 C7.2 | SV1.6 65.57,5.3 65.57,11.95 65.33,12.2 51.65,12.2 v49.07,14.77 | 47.09,21.38 47.17,21.38 49.68,18.87 50.59,18.87 v52,17.46 | U2.15 53.94,19.35 v53.79,19.35 | U2.15 | U2.15
  Bottom 0.25: v49.07,14.77 49.31,14.77 v52,17.46 52,17.56 v53.79,19.35

### Text on the board
tPlace: PSoC Loki v0.2.0
bNames: DP8049_v1